# EAGLE design ats (EAGLE 9.6.1)
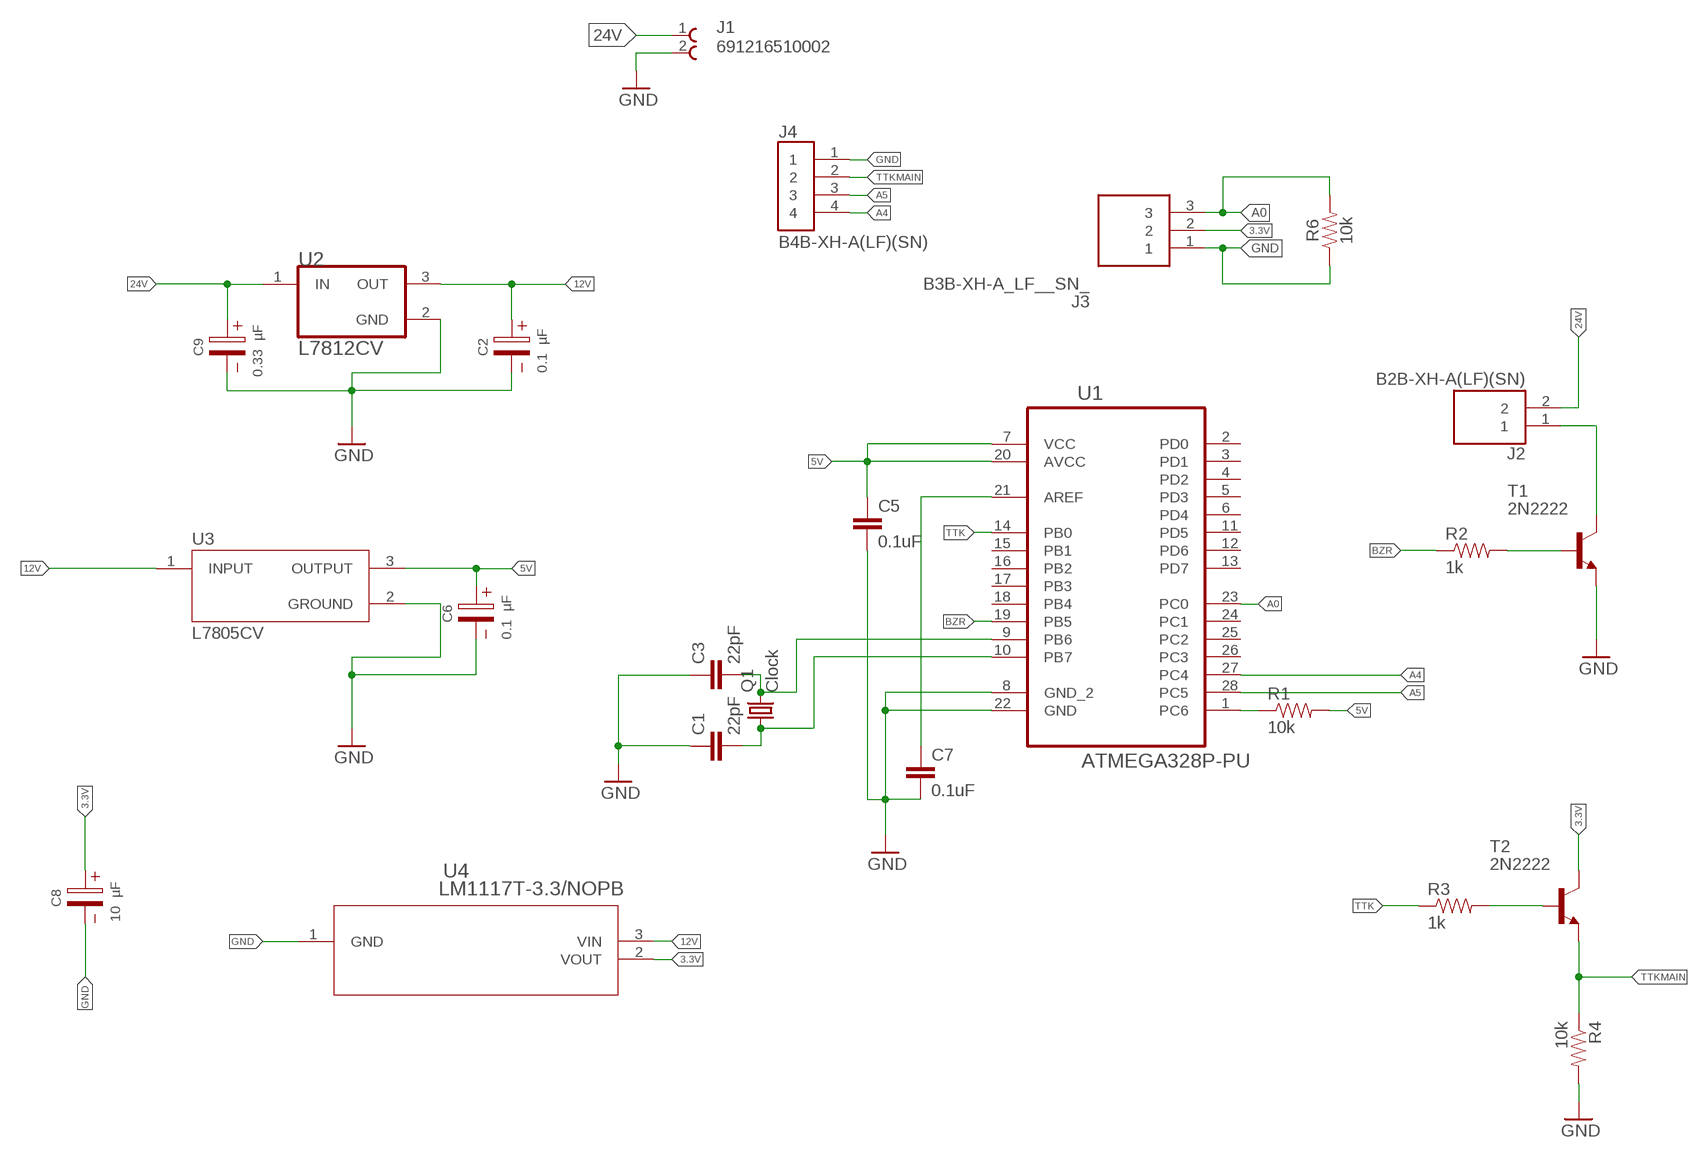
[diagram p0: schematic, sheet 1]

## Parts
C1  22pF  22PF-PTH-2.54MM-200V-5%  [CAP-PTH-2.54]
C2  0.1 µF  WCAP-ATG5_5X11_860020772001  [WCAP-ATG5_5X11(DXL)]
C3  22pF  22PF-PTH-2.54MM-200V-5%  [CAP-PTH-2.54]
C5  0.1uF  0.1UF-KIT-EZ-50V-20%  [CAP-PTH-SMALL-KIT]
C6  0.1 µF  WCAP-ATG5_5X11_860020772001  [WCAP-ATG5_5X11(DXL)]
C7  0.1uF  0.1UF-KIT-EZ-50V-20%  [CAP-PTH-SMALL-KIT]
C8  10 µF  WCAP-ATG5_5X11_860020372001  [WCAP-ATG5_5X11(DXL)]
C9  0.33 µF  WCAP-ATG5_5X11_860020772003  [WCAP-ATG5_5X11(DXL)]
J1  691216510002  [691216510002]
J2  B2B-XH-A(LF)(SN)  [JST_B2B-XH-A(LF)(SN)]
J3  B3B-XH-A_LF__SN_  [SHDR3W64P0X250_1X3_990X575X700]
J4  B4B-XH-A(LF)(SN)  [JST_B4B-XH-A(LF)(SN)]
Q1  Clock  CRYSTALHC49S  [HC49/S]
R1  10k  10KOHM-HORIZ-1/4W-5%  [AXIAL-0.3]
R2  1k  1KOHM-HORIZ-1/4W-5%  [AXIAL-0.3]
R3  1k  1KOHM-HORIZ-1/4W-5%  [AXIAL-0.3]
R4  10k  10KOHM-HORIZ-1/4W-5%  [AXIAL-0.3]
R6  10k  10KOHM-HORIZ-1/4W-5%  [AXIAL-0.3]
T1  2N2222  [TO92-EBC-OVAL]
T2  2N2222  [TO92-EBC-OVAL]
U1  ATMEGA328P-PU  [DIP254P762X457-28]
U2  L7812CV  [TO-220-3]
U3  L7805CV  [TO255P1040X460X1968-3]
U4  LM1117T-3.3/NOPB  [T03B_TEX]

## Nets
3.3V: C8.1(+) J3.2 T2.C U4.2(VOUT)
5V: C5.1 C6.1(+) R1.P$2 U1.7(VCC) U1.20(AVCC) U3.3(OUTPUT)
12V: C2.1(+) U2.3(OUT) U3.1(INPUT) U4.3(VIN)
24V: C9.1(+) J1.1 J2.2 U2.1(IN)
A0: J3.3 R6.P$2 U1.23(PC0)
A4: J4.4 U1.27(PC4)
A5: J4.3 U1.28(PC5)
BZR: R2.P$1 U1.19(PB5)
GND: C1.1 C2.2(-) C3.1 C5.2 C6.2(-) C7.2 C8.2(-) C9.2(-) J1.2 J3.1 J4.1 R4.P$2 R6.P$1 T1.E U1.8(GND_2) U1.22(GND) U2.2(GND) U3.2(GROUND) U4.1(GND)
N$1: R1.P$1 U1.1(PC6)
N$2: J2.1 T1.C
N$3: R2.P$2 T1.B
N$4: C3.2 Q1.2 U1.9(PB6)
N$5: C1.2 Q1.1 U1.10(PB7)
N$6: C7.1 U1.21(AREF)
N$7: R3.P$2 T2.B
TTK: R3.P$1 U1.14(PB0)
TTKMAIN: J4.2 R4.P$1 T2.E
Unconnected: U1.2(PD0) U1.3(PD1) U1.4(PD2) U1.5(PD3) U1.6(PD4) U1.11(PD5) U1.12(PD6) U1.13(PD7) U1.15(PB1) U1.16(PB2) U1.17(PB3) U1.18(PB4) U1.24(PC1) U1.25(PC2) U1.26(PC3)

## Library data of the parts
C1 C3 = SparkFun-Capacitors-01uf:22PF: 22pF ceramic capacitors A capacitor is a passive two-terminal electrical component used to store electrical energy temporarily in an electric field.; PROD_ID: CAP-09128
C2 C6 = Wurth_Capacitors_WCAP-ATG5-01uf-033uf:WCAP-ATG5_5X11: WCAP-ATG5 Aluminium Electrolytic Capacitors General Purpose +105 °C Characteristics General purpose product series with max. operating temperature of +105 °C Mounting style: THT Radial Capacitance range: 0.1 µF ‒ 18000 µF Capacitance tolerance: ±20 % Operating temperature: -40 °C up to +105 °C for UR < 400 V(DC) -25 °C up to +105 °C for UR ≥ 400 V(DC) Endurance: 2000 h @ +105 °C Dimensions (DxL) in mm: 5.0 x 11.0 up to 22.0 x 31.0 Recommended soldering: Wave soldering Applications Filtering Smoothing Energy storage Coupling e.g. Switched-mode power supply, AC/DC converter, adapter, charger, digital camera <https://www.we-online.com/catalog/media/o35284v209%20WCAP-ATG5_4C.jpg> Details see: https://www.we-online.com/catalog/en/WCAP-ATG5/ Updated by yingchun,Shan;2020-02-28 2020(C) Würth Elektronik; DATASHEET-URL: https://www.we-online.com/catalog/datasheet/860020772001.pdf; DF: 9%; DIAMETER: 5mm; I-LEAK: 3uA; I-RIPPLE: 1.3mA; L: 11mm; OPERATING-TEMPERATURE: -40 °C up to +105 °C; PART-NUMBER: 860020772001; PITCH: 2mm; TECHNICAL-REFERENCE: ATDC110R10M063DSPA3B000; VR: 63V(DC)
C5 C7 = SparkFun-Capacitors-01uf:0.1UF: 0.1µF ceramic capacitors A capacitor is a passive two-terminal electrical component used to store electrical energy temporarily in an electric field.; PROD_ID: CAP-08370
C8 = Wurth_Capacitors_WCAP-ATG5-01uf-033uf:WCAP-ATG5_5X11: WCAP-ATG5 Aluminium Electrolytic Capacitors General Purpose +105 °C Characteristics General purpose product series with max. operating temperature of +105 °C Mounting style: THT Radial Capacitance range: 0.1 µF ‒ 18000 µF Capacitance tolerance: ±20 % Operating temperature: -40 °C up to +105 °C for UR < 400 V(DC) -25 °C up to +105 °C for UR ≥ 400 V(DC) Endurance: 2000 h @ +105 °C Dimensions (DxL) in mm: 5.0 x 11.0 up to 22.0 x 31.0 Recommended soldering: Wave soldering Applications Filtering Smoothing Energy storage Coupling e.g. Switched-mode power supply, AC/DC converter, adapter, charger, digital camera <https://www.we-online.com/catalog/media/o35284v209%20WCAP-ATG5_4C.jpg> Details see: https://www.we-online.com/catalog/en/WCAP-ATG5/ Updated by yingchun,Shan;2020-02-28 2020(C) Würth Elektronik; DATASHEET-URL: https://www.we-online.com/catalog/datasheet/860020372001.pdf; DF: 15%; DIAMETER: 5mm; I-LEAK: 3uA; I-RIPPLE: 35mA; L: 11mm; OPERATING-TEMPERATURE: -40 °C up to +105 °C; PART-NUMBER: 860020372001; PITCH: 2mm; TECHNICAL-REFERENCE: ATDC110100M016DSPA3B000; VR: 16V(DC)
C9 = Wurth_Capacitors_WCAP-ATG5-01uf-033uf:WCAP-ATG5_5X11: WCAP-ATG5 Aluminium Electrolytic Capacitors General Purpose +105 °C Characteristics General purpose product series with max. operating temperature of +105 °C Mounting style: THT Radial Capacitance range: 0.1 µF ‒ 18000 µF Capacitance tolerance: ±20 % Operating temperature: -40 °C up to +105 °C for UR < 400 V(DC) -25 °C up to +105 °C for UR ≥ 400 V(DC) Endurance: 2000 h @ +105 °C Dimensions (DxL) in mm: 5.0 x 11.0 up to 22.0 x 31.0 Recommended soldering: Wave soldering Applications Filtering Smoothing Energy storage Coupling e.g. Switched-mode power supply, AC/DC converter, adapter, charger, digital camera <https://www.we-online.com/catalog/media/o35284v209%20WCAP-ATG5_4C.jpg> Details see: https://www.we-online.com/catalog/en/WCAP-ATG5/ Updated by yingchun,Shan;2020-02-28 2020(C) Würth Elektronik; DATASHEET-URL: https://www.we-online.com/catalog/datasheet/860020772003.pdf; DF: 9%; DIAMETER: 5mm; I-LEAK: 3uA; I-RIPPLE: 4.5mA; L: 11mm; OPERATING-TEMPERATURE: -40 °C up to +105 °C; PART-NUMBER: 860020772003; PITCH: 2mm; TECHNICAL-REFERENCE: ATDC110R33M063DSPA3B000; VR: 63V(DC)
J1 = 691216510002:691216510002: WR-TBL Serie 2165 - 5.08mm Horizontal Entry Modular with Rising Cage Clamp - 3.5mm2 Wires, 2 Pins=>Code : Con_TBL_Screw_RisingClamp_5.08_691216510002 <http://katalog.we-online.de/media/images/eican/Con_TBL_Screw_RisingClamp_5.08_6912165100xx_pf2.jpg> Details see: http://katalog.we-online.de/en/em/691_216_510_0xx Created 2014-06-18, Karrer Zheng 2014 (C) Würth Elektronik; AVAILABILITY: Unavailable; DESCRIPTION: 2 Position Wire to Board Terminal Block Horizontal with Board 0.200 (5.08mm) Through Hole; MF: Wurth Electronics; MP: 691216510002; PACKAGE: None; PRICE: None
J2 = B2B-XH-A_LF__SN_:B2B-XH-A(LF)(SN): XH Series 2 Position 2.5 mm Pitch Through Hole Top Entry Shrouded Header; ARROW_ELECTRONICS-PURCHASE-URL: https://snapeda.com/shop?store=Arrow+Electronics&id=492310; DESCRIPTION: Connector Header Through Hole 2 position 0.098 (2.50mm); DIGI-KEY_PART_NUMBER: 455-2247-ND; DIGIKEY-PURCHASE-URL: https://snapeda.com/shop?store=DigiKey&id=492310; MF: JST Sales; MP: B2B-XH-A(LF)(SN); PACKAGE: None
J3 = B3B-XH-A_LF__SN_:B3B-XH-A_LF__SN_: XH-2.5mm Header top entry 3 way JST XH Series, Series Number B3B, 2.5mm Pitch 3 Way 1 Row Straight PCB Header, Solder Termination, 3A Source: Datasheet <http://docs-emea.rs-online.com/webdocs/1357/0900766b81357f2f.pdf>; ARROW_PART_NUMBER: B3B-XH-A(LF)(SN); ARROW_PRICE-STOCK: https://www.arrow.com/en/products/b3b-xh-a-lf-sn/jst-manufacturing; DESCRIPTION: XH-2.5mm Header top entry 3 way JST XH Series, Series Number B3B, 2.5mm Pitch 3 Way 1 Row Straight PCB Header, Solder Termination, 3A; HEIGHT: 7mm; MANUFACTURER_NAME: JST (JAPAN SOLDERLESS TERMINALS); MANUFACTURER_PART_NUMBER: B3B-XH-A(LF)(SN)
J4 = B4B-XH-A_LF__SN_:B4B-XH-A(LF)(SN): XH Series 4 Position 2.5 mm Pitch Through Hole Crimp Top Entry Shrouded Header; DESCRIPTION: Connector Header Through Hole 4 position 0.098 (2.50mm); DIGI-KEY_PART_NUMBER: 455-2249-ND; MF: JST Sales; MP: B4B-XH-A(LF)(SN); PACKAGE: None
Q1 = adafruitHC-49S(Buyuk):CRYSTAL: CRYSTAL; OC_FARNELL: 1667008; OC_NEWARK: unknown
R1 R4 R6 = SparkFun-Resistors-10k:10KOHM: 10kΩ resistor A resistor is a passive two-terminal electrical component that implements electrical resistance as a circuit element. Resistors act to reduce current flow, and, at the same time, act to lower voltage levels within circuits. - Wikipedia; PROD_ID: RES-09435
R2 R3 = SparkFun-Resistors-1k:1KOHM: 1kΩ resistor A resistor is a passive two-terminal electrical component that implements electrical resistance as a circuit element. Resistors act to reduce current flow, and, at the same time, act to lower voltage levels within circuits. - Wikipedia; PROD_ID: RES-08380
T1 T2 = adafruit:2N2222: NPN TRANSISTOR Big oval pads
U1 = ats_lbr:ATMEGA328P-PU: 8-bit Microcontroller with In-System Programmable Flash; MPN: ATMEGA328P-PU; OC_FARNELL: 1715487; OC_NEWARK: 68T2944; PACKAGE: PDIP-28; SUPPLIER: Atmel
U2 = L7812CV:L7812CV: IC REG LINEAR 12V 1.5A TO220AB; DESCRIPTION: Linear Voltage Regulator IC 1 Output 1.5A TO-220; DIGI-KEY_PART_NUMBER: 497-12406-ND; MF: STMicroelectronics; MP: L7812CV; PACKAGE: TO-220 Texas Instruments
U3 = L7805CV:L7805CV: Standard Regulator Pos 5V 1.5A 3-Pin(3+Tab) TO-220 Standard Regulator Pos 5V 1.5A 3-Pin(3+Tab) TO-220; DESCRIPTION: Linear Voltage Regulator IC 1 Output 1.5A TO-220; DIGI-KEY_PART_NUMBER: 497-12404-ND; MF: STMicroelectronics; MP: L7805CV; PACKAGE: TO-220 STMicroelectronics
U4 = LM1117T:LM1117T-3.3/NOPB; BUILT_BY: EMA_UL_Team; COPYRIGHT: Copyright (C) 2018 Accelerated Designs. All rights reserved; MANUFACTURER_PART_NUMBER: LM1117T-3.3/NOPB; SOURCELIBRARY: National_2011-09-26; VENDOR: Texas Instruments

## Board
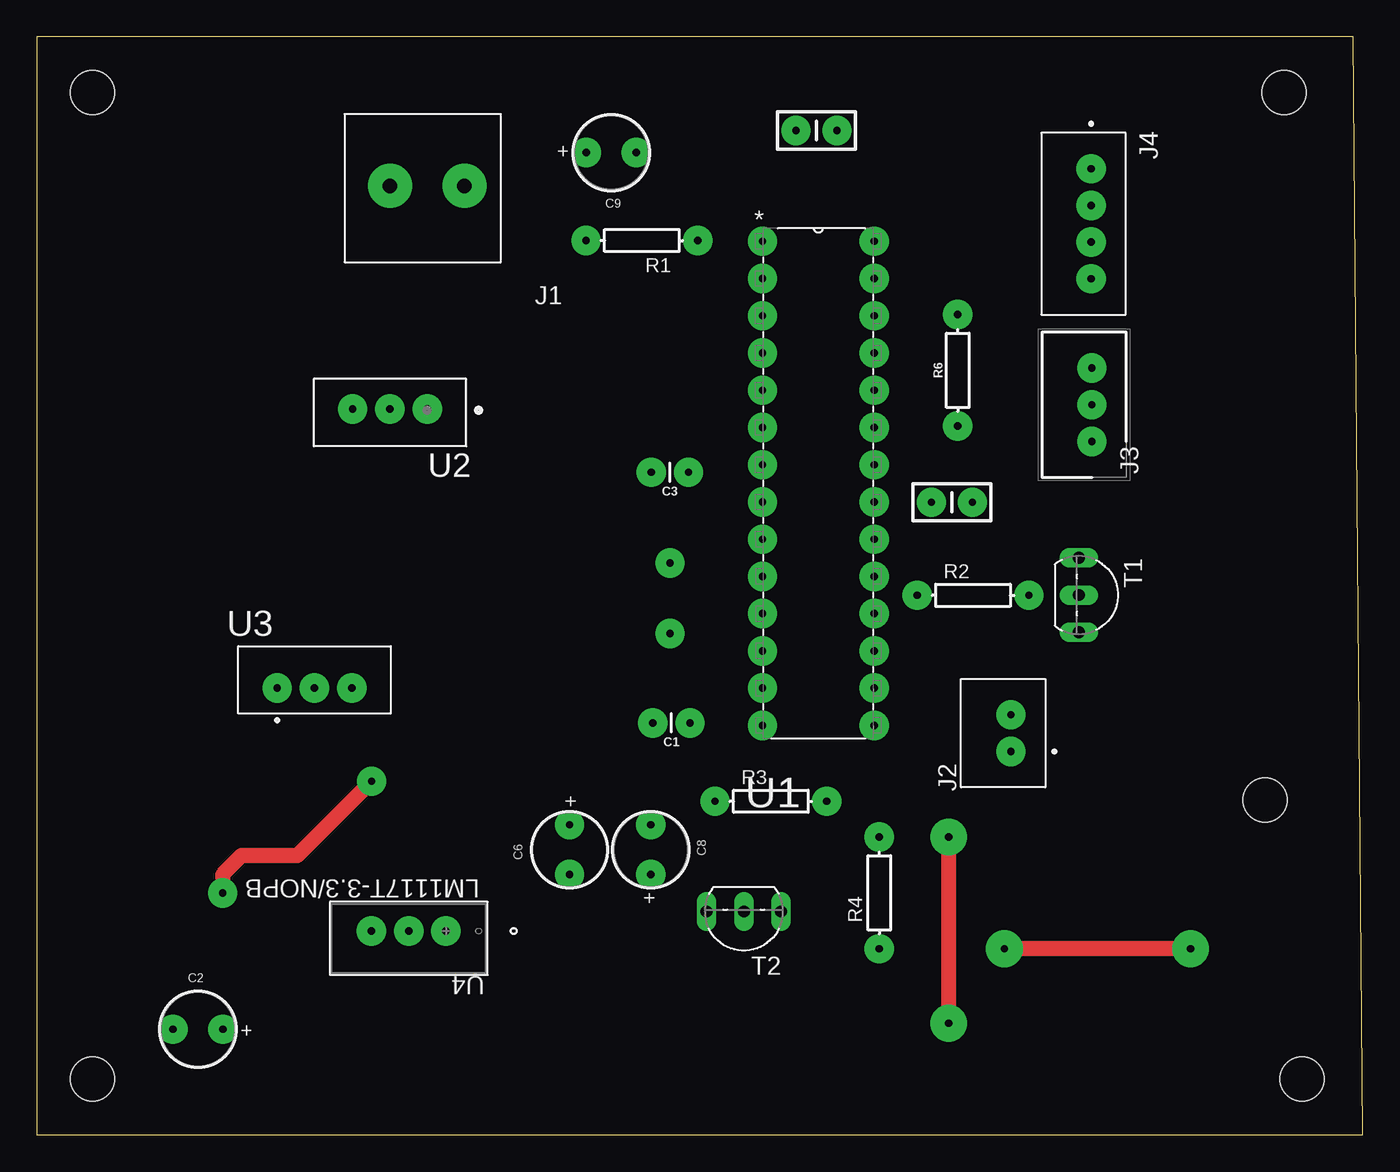
[diagram p1: board, top side]
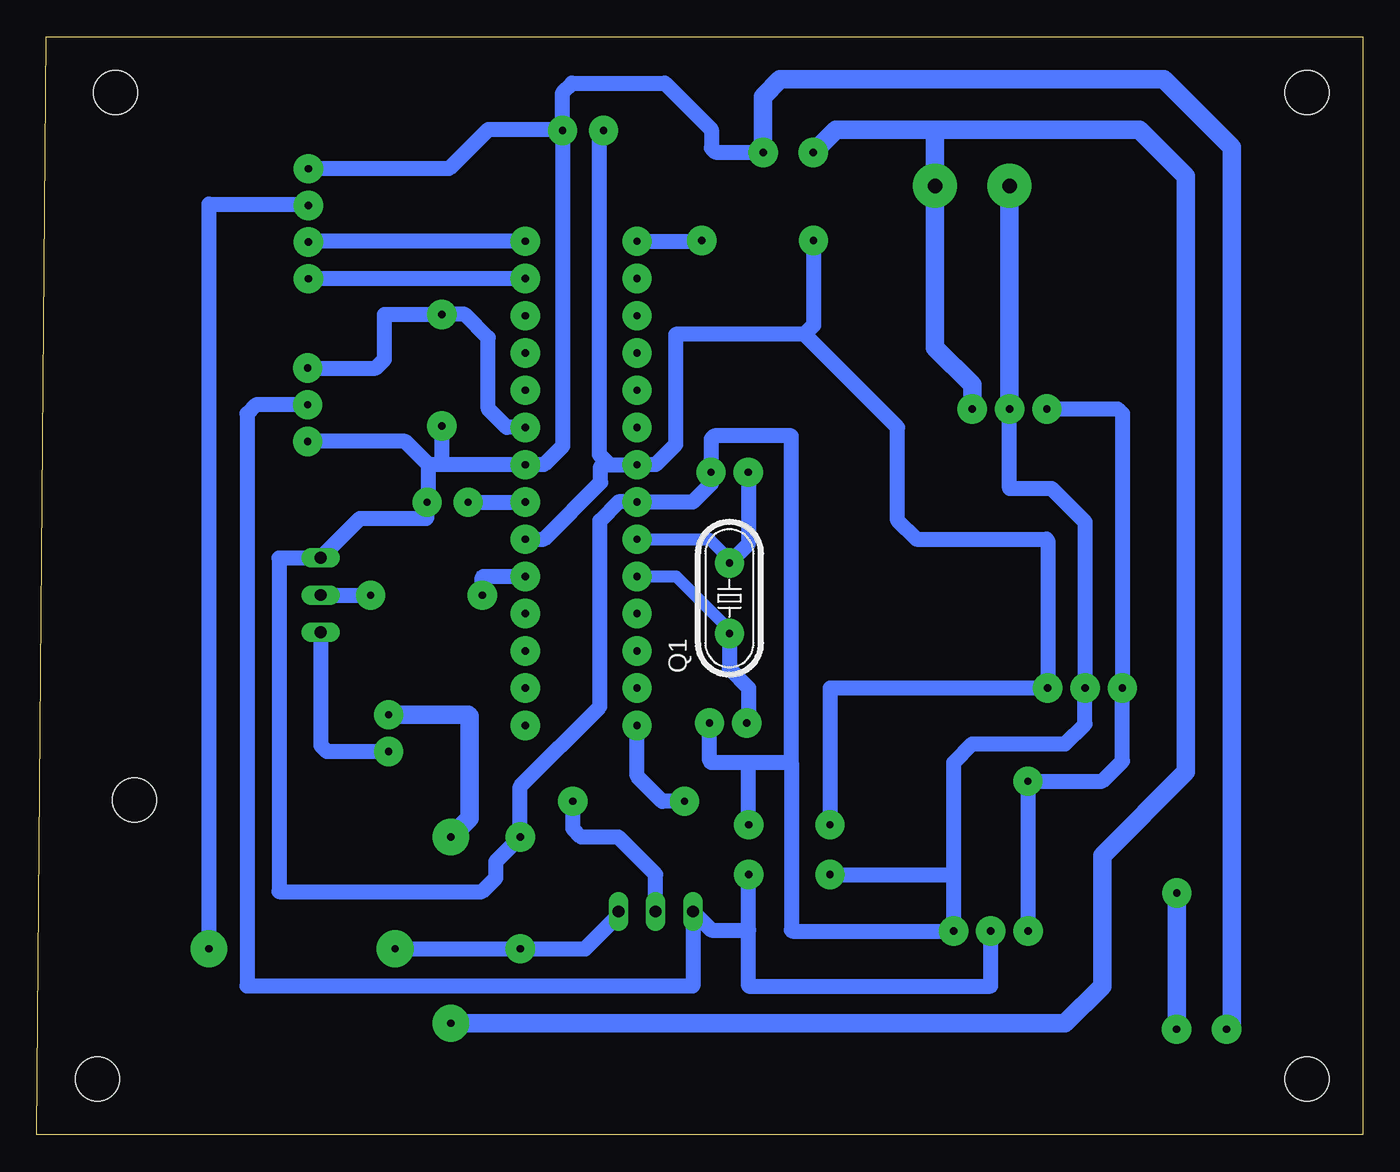
[diagram p2: board, bottom side, seen from below]

Size 90.5 x 74.92 mm. Coordinates in mm from the lower left corner, seen from the top.
Outline: 0,0 90.5,0 89.84,74.92 0,74.92 0,0
Copper layers (1*16): Top 0.035mm / dielectric 1.5mm / Bottom 0.035mm
Design rules "default": minimum track width 6mil, minimum drill 0.35mm, track to track 6mil, track to pad 6mil, pad to pad 6mil, via to via 6mil, smd to smd 6mil, copper to edge 40mil, drill to drill 6mil, minimum pad ring 10mil, minimum via ring 8mil, stop-mask expansion 4mil, vias tented up to drill 0mil, thermal gap 10mil
Holes 3 mm at 3.81,71.11 85.11,71.11 3.81,3.81 86.36,3.81 83.81,22.86

### Footprints (pad centres in the part's own frame; a part is rotated, then mirrored left to right if it is on the bottom)
CAP-PTH-2.54 = drill 0.5 pad 2: 1 -1.27,0; 2 1.27,0
WCAP-ATG5_5X11(DXL) = drill 0.5 pad 2: 1 1.7,0; 2 -1.7,0
CAP-PTH-SMALL-KIT = drill 0.5 pad 2: 1 -1.397,0; 2 1.397,0
691216510002 = drill 1 pad 3: 1 -5.08,0; 2 0,0
JST_B2B-XH-A(LF)(SN) = drill 0.5 pad 2: 1 -1.25,-0.525; 2 1.25,-0.525
SHDR3W64P0X250_1X3_990X575X700 = drill 0.5 pad 2: 1 0,0; 2 2.5,0; 3 5,0
JST_B4B-XH-A(LF)(SN) = drill 0.5 pad 2: 1 0,0; 2 2.5,0; 3 5,0; 4 7.5,0
HC49/S = drill 0.5 pad 2: 1 -2.413,0; 2 2.413,0
AXIAL-0.3 = drill 0.5 pad 2: P$1 -3.81,0; P$2 3.81,0
TO92-EBC-OVAL = drill 0.813 long: B 0,-1.27; C 2.54,-1.27; E -2.54,-1.27
DIP254P762X457-28 = drill 0.5 pad 2: 1 -7.62,33.02; 2 -7.62,30.48; 3 -7.62,27.94; 4 -7.62,25.4; 5 -7.62,22.86; 6 -7.62,20.32; 7 -7.62,17.78; 8 -7.62,15.24; 9 -7.62,12.7; 10 -7.62,10.16; 11 -7.62,7.62; 12 -7.62,5.08; 13 -7.62,2.54; 14 -7.62,0; 15 0,0; 16 0,2.54; 17 0,5.08; 18 0,7.62; 19 0,10.16; 20 0,12.7; 21 0,15.24; 22 0,17.78; 23 0,20.32; 24 0,22.86; 25 0,25.4; 26 0,27.94; 27 0,30.48; 28 0,33.02
TO-220-3 = drill 0.5 pad 2: 1 -2.55,-0.26; 2 0,-0.26; 3 2.55,-0.26
TO255P1040X460X1968-3 = drill 0.5 pad 2: 1 0,0; 2 2.55,0; 3 5.1,0
T03B_TEX = drill 0.5 pad 2: 1 0,0; 2 2.54,0; 3 5.08,0

### Placement (x,y rotation side)
C1  43.31,28.11 180 top
C2  11.01,7.21 0 top
C3  43.21,45.21 180 top
C5  53.21,68.52 0 top
C6  36.36,19.46 90 top
C7  62.46,43.16 0 top
C8  41.91,19.46 270 top
C9  39.21,67.01 180 top
J1  24.11,64.74 180 top
J2  65.96,27.41 90 top
J3  72.01,47.31 90 top
J4  71.96,65.91 270 top
Q1  43.22,36.61 90 bottom
R1  41.3,61.01 180 top
R2  63.9,36.81 0 top
R3  50.1,22.76 0 top
R4  57.5,16.51 90 top
R6  62.86,52.16 90 top
T1  72.39,36.83 270 top
T2  48.26,13.97 180 top
U1  57.15,27.94 0 top
U2  24.11,49.27 180 top
U3  16.41,30.48 0 top
U4  27.93,13.91 180 top

### Tracks (layer width: path | path; a pad name or v marks a point on that pad's centre or on a via)
3.3V
  Bottom 1.016: 41.91,13.97 44.45,13.97 T2.C 45.72,10.16 76.15,10.16 76.15,49.2 75.54,49.81 J3.2 | 41.91,13.97 41.91,10.16 25.4,10.16 25.39,10.17 U4.2 | 41.91,13.97 C8.1
5V
  Bottom 1.016: U1.20 55.88,40.64 52.01,44.51 52.01,45.61 51.9,45.72 51.41,45.72 | 38.1,54.61 46.89,54.61 46.89,47.09 48.26,45.72 U1.7 51.41,45.72 | 38.1,54.61 31.75,48.26 31.75,41.91 30.48,40.64 21.59,40.64 21.51,40.56 U3.3 36.36,30.48 C6.1 | R1.P$2 37.49,55.22 38.1,54.61 | C5.1 52.11,68.22 52.11,46.42 51.41,45.72
12V  (via drill 0.5 pad 2)
  Top 1.016: v22.86,24.13 17.78,19.05 13.97,19.05 12.7,17.78 v12.7,16.51
  Bottom 1.016: U2.3 16.73,49.53 16.41,49.21 U3.1 16.41,25.5 17.78,24.13 v22.86,24.13 U4.3
  Bottom 1.27: v12.7,16.51 C2.1
24V  (via drill 0.5 pad 2.5)
  Top 1.016: v62.23,20.32 v62.23,7.62
  Bottom 1.27: 29.01,68.58 15.24,68.58 12.07,65.41 12.07,24.76 17.78,19.05 17.78,10.16 20.32,7.62 v62.23,7.62 | v62.23,20.32 60.96,21.59 60.96,28.56 61.06,28.66 J2.2 | 29.01,68.58 29.19,68.4 J1.1 29.19,53.69 26.66,51.16 U2.1 | C9.1 35.94,68.58 29.01,68.58
A0
  Bottom 1.016: U1.23 58.42,48.26 59.69,49.53 59.69,54.39 61.27,55.97 R6.P$2 66.75,55.97 66.76,55.96 66.76,52.91 67.36,52.31 J3.3
A4
  Bottom 1.016: U1.27 J4.4
A5
  Bottom 1.016: U1.28 71.91,60.96 J4.3
BZR
  Bottom 1.016: R2.P$1 60.09,38.03 60.02,38.1 U1.19
GND
  Bottom 1.016: 62.76,45.72 U1.22 55.88,45.72 54.61,46.99 C5.2 | 62.76,45.72 63.76,45.72 | 39,25.4 41.91,25.4 | 41.91,25.4 44.45,25.4 44.58,25.53 C1.1 | 39,25.4 39,13.97 38.94,13.91 U4.1 27.93,17.85 | 39,25.4 39,47.69 44.25,47.69 44.48,47.46 C3.1 44.48,44.42 45.72,43.18 U1.8 50.8,43.18 52.07,41.91 52.07,29.21 57.5,23.78 R4.P$2 59.16,18.66 59.16,17.54 60.11,16.59 73.96,16.59 73.96,39.37 T1.E 68.44,42.05 63.92,42.05 63.86,42.11 C7.2 63.76,43.26 63.76,45.72 | C9.2 40.95,67.05 44.19,67.05 44.45,67.31 44.45,68.58 47.62,71.75 53.98,71.75 54.61,71.12 C5.2 | C5.2 54.71,68.42 | C5.2 54.67,68.58 59.69,68.58 62.36,65.91 J4.1 | U2.2 24.11,44.11 21.25,44.11 18.96,41.82 U3.2 18.96,28.03 20.32,26.67 26.67,26.67 27.94,25.4 27.94,17.86 27.93,17.85 | C6.2 28.02,17.76 27.93,17.85 | C8.2 41.91,25.4 | 62.76,45.72 62.86,45.82 R6.P$1 | 63.76,45.72 65.35,47.31 J3.1
  Bottom 1.27: 40.95,66.85 40.95,67.05 40.95,70.81 39.76,72 13.58,72 8.96,67.38 8.96,7.56 C2.2 | J1.2 U2.2
N$1
  Bottom 1.016: U1.1 45.16,60.96 R1.P$1
N$2
  Bottom 1.016: J2.1 70.71,26.16 71.12,26.57 T1.C
N$3
  Bottom 1.016: T1.B 67.73,36.83 R2.P$2
N$4
  Bottom 0.813: U1.9 44.58,40.64 43.22,39.29 Q1.2
  Bottom 1.016: Q1.2 41.94,40.31 C3.2
N$5
  Bottom 0.813: U1.10 46.86,38.1 43.22,34.46 Q1.1
  Bottom 1.016: Q1.1 43.22,31.79 41.91,30.48 41.91,28.24 C1.2
N$6
  Bottom 1.016: C7.1 57.17,43.16 U1.21
N$7
  Bottom 1.016: T2.B 48.26,17.78 50.8,20.32 53.34,20.32 53.91,20.89 R3.P$2
TTK
  Bottom 1.016: R3.P$1 47.81,22.76 49.53,24.48 U1.14
TTKMAIN  (via drill 0.5 pad 2.5)
  Top 1.016: v78.74,12.7 v66.04,12.7
  Bottom 1.016: v78.74,12.7 78.74,63.5 72.05,63.5 J4.2 | v66.04,12.7 R4.P$1 53.07,12.7 50.8,14.97 T2.E